# Altium project MD1800_5V800mA.PrjPcb
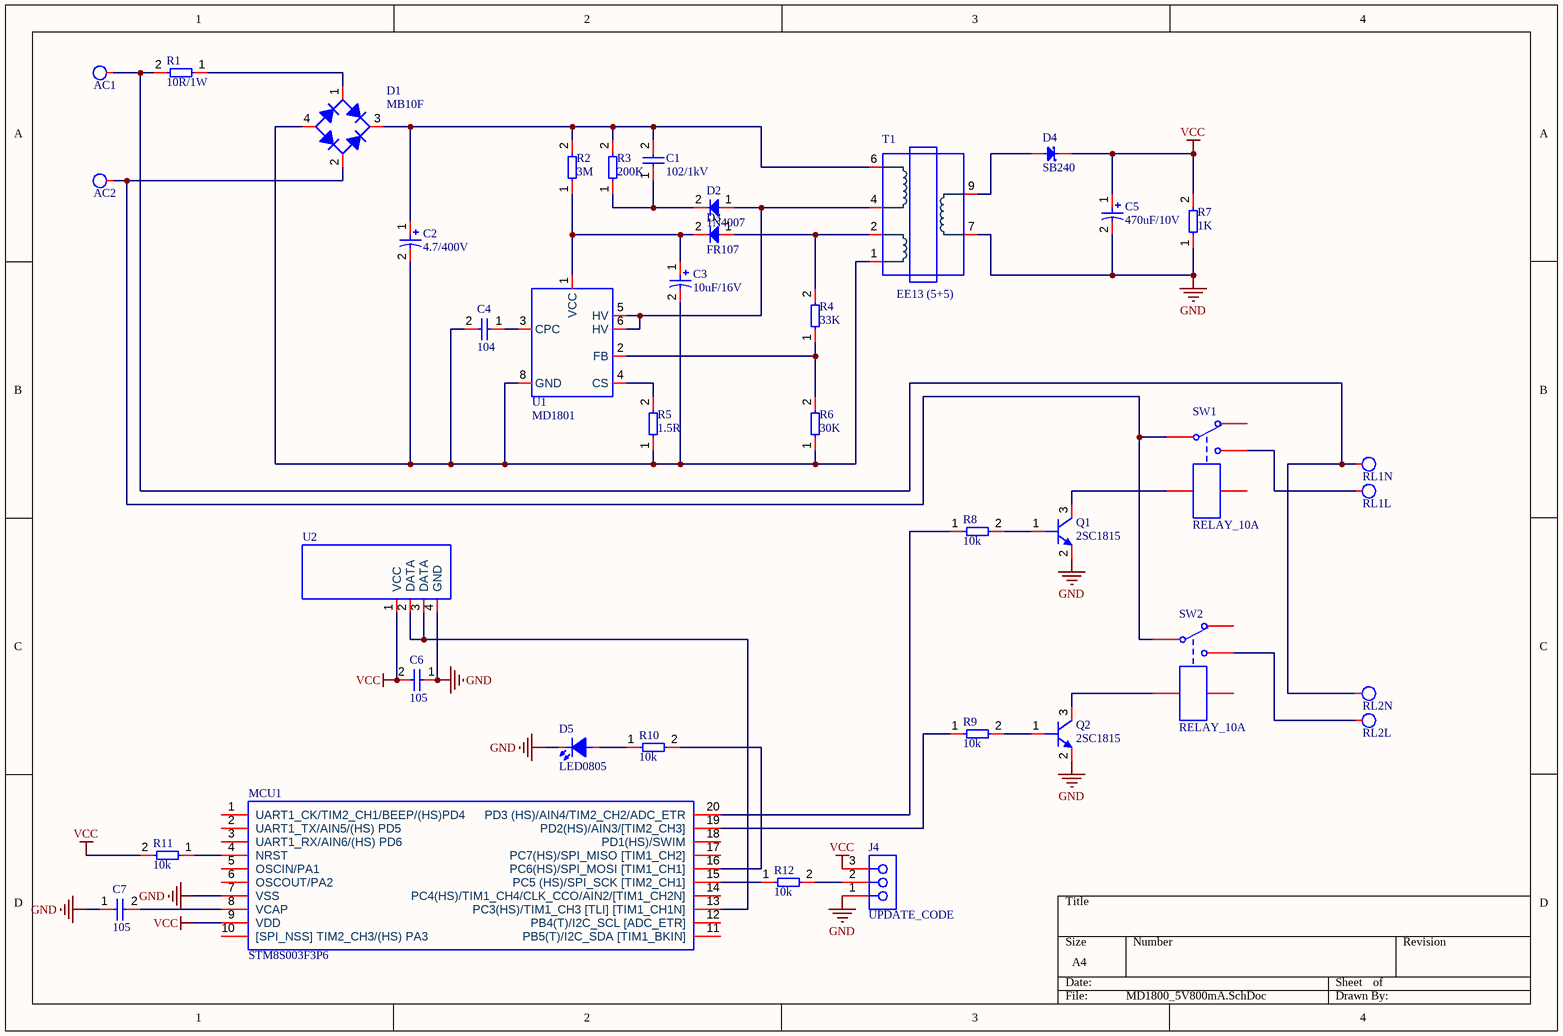
[diagram p0: MD1800_5V800mA.SchDoc]
1 sheet, 39 parts. Net scope: global (net labels, ports and power ports of the same name join across sheets).
Board file: MD1800_5V800mA.PcbDoc

## Sheet MD1800_5V800mA.SchDoc
size A4; SheetNumber: 1; SheetTotal: 1

### Parts
AC1  AC  [SolderPoint]  (value not drawn)
AC2  AC  [SolderPoint]  (value not drawn)
C1  102/1kV  [C0805]
C2  4.7/400V  [CAP_RAD_3.5mm]
C3  10uF/16V  [CAP_RAD_2.5mm]
C4  104  [C0805]
C5  470uF/10V  [CAP_RAD_3.5mm]
C6  105  [C0805]
C7  105  [C0805]
D1  MB10F  [MB10F-TMBS]
D2  1N4007  [SOD-123FL]
D3  FR107  [SOD-123FL]
D4  SB240  [DO-214AC(SMA)]
D5  LED0805  [L0805RED]
J4  UPDATE_CODE  [Header 3x1 TH Pitch 2.54mm]
MCU1  STM8S003F3P6  [TSSOP20_0.65_4.4]
Q1  2SC1815  [SOT23-3]
Q2  2SC1815  [SOT23-3]
R1  10R/1W  [RES-1W-V-MF]
R2  3M  [R0805]
R3  200K  [R0805]
R4  33K  [R0805]
R5  1.5R  [R0805]
R6  30K  [R0805]
R7  1K  [R0805]
R8  10k  [R0805]
R9  10k  [R0805]
R10  10k  [R0805]
R11  10k  [R0805]
R12  10k  [R0805]
RL1L  AC  [SolderPoint]  (value not drawn)
RL1N  AC  [SolderPoint]  (value not drawn)
RL2L  AC  [SolderPoint]  (value not drawn)
RL2N  AC  [SolderPoint]  (value not drawn)
SW1  RELAY_10A  [RELAY_10A_5PIN]
SW2  RELAY_10A  [RELAY_10A_5PIN]
T1  EE13 (5+5)  [TRANS_EE19F]
U1  MD1801  [SOIC-7]
U2  RF433_315_RECEVICE  [RF433_315_RECEVICE]  (value not drawn)

### Nets
GND: C5.2 C6.1 C7.1 D5.2(K) J4.1 MCU1.7(VSS) Q1.2(E) Q2.2(E) R7.1 T1.7 U2.4(GND)
VCC: C5.1 C6.2 D4.2(K) J4.3 MCU1.9(VDD) R7.2 R11.2 U2.1(VCC)
NetAC1_1: AC1.1 R1.2 RL1N.1 RL2N.1
NetAC2_1: AC2.1 D1.2(AC) SW1.2 SW2.2
NetC1_1: C1.1 D2.2 R3.1
NetC1_2: C1.2 C2.1 D1.3(+) R2.2 R3.2 T1.6
NetC2_2: C2.2 C3.2 C4.2 D1.4(-) R5.1 R6.1 T1.1 U1.8(GND)
NetC3_1: C3.1 D3.2 R2.1 U1.1(VCC)
NetC4_1: C4.1 U1.3(CPC)
NetC7_2: C7.2 MCU1.8(VCAP)
NetD1_1: D1.1(AC) R1.1
NetD2_1: D2.1 T1.4 U1.5(HV) U1.6(HV)
NetD3_1: D3.1 R4.2 T1.2
NetD4_1: D4.1(A) T1.9
NetD5_1: D5.1(A) R10.1
NetJ4_2: J4.2 R12.2
NetMCU1_4: MCU1.4(NRST) R11.1
NetMCU1_13: MCU1.13(PC3(HS)/TIM1_CH3_[TLI]_[TIM1_CH1N]) U2.2(DATA) U2.3(DATA)
NetMCU1_15: MCU1.15(PC5_(HS)/SPI_SCK_[TIM2_CH1]) R12.1
NetMCU1_16: MCU1.16(PC6(HS)/SPI_MOSI_[TIM1_CH1]) R10.2
NetMCU1_19: MCU1.19(PD2(HS)/AIN3/[TIM2_CH3]) R9.1
NetMCU1_20: MCU1.20(PD3_(HS)/AIN4/TIM2_CH2/ADC_ETR) R8.1
NetQ1_1: Q1.1(B) R8.2
NetQ1_3: Q1.3(C) SW1.1
NetQ2_1: Q2.1(B) R9.2
NetQ2_3: Q2.3(C) SW2.1
NetR4_1: R4.1 R6.2 U1.2(FB)
NetR5_2: R5.2 U1.4(CS)
NetRL1L_1: RL1L.1 SW1.5
NetRL2L_1: RL2L.1 SW2.5

Not connected (* = marked no-connect by the designer): MCU1 1(UART1_CK/TIM2_CH1/BEEP/(HS)PD4) 2(UART1_TX/AIN5/(HS)_PD5) 3(UART1_RX/AIN6/(HS)_PD6) 5(OSCIN/PA1) 6(OSCOUT/PA2) 10([SPI_NSS]_TIM2_CH3/(HS)_PA3) 11(PB5(T)/I2C_SDA_[TIM1_BKIN]) 12(PB4(T)/I2C_SCL_[ADC_ETR]) 14(PC4(HS)/TIM1_CH4/CLK_CCO/AIN2/[TIM1_CH2N]) 17(PC7(HS)/SPI_MISO_[TIM1_CH2]) 18(PD1(HS)/SWIM); SW1 3 4; SW2 3 4

### Library data of the parts
AC1 AC2 RL1L RL1N RL2L RL2N = SolderPoint
C1 C4 C6 C7 = C0805
C2 C3 C5 = Capacitor(Radian)
D1 = MB10F: 1A 1000V
D2 D3 = Diode FR107: 1A 1000V
D4 = Diode Schottky
J4 = Header 3x1 TH Pitch 2.54mm
Q1 Q2 = 2SC1815 (SOT-23)
R1 = Resistors THD
R2-R12 = Resistor SMD
T1 = Trans-EE19F
U1 = MD1801: Power Switching IC
U2 = RF433_315